# EAGLE schematic Magellan (EAGLE 9.6.2)
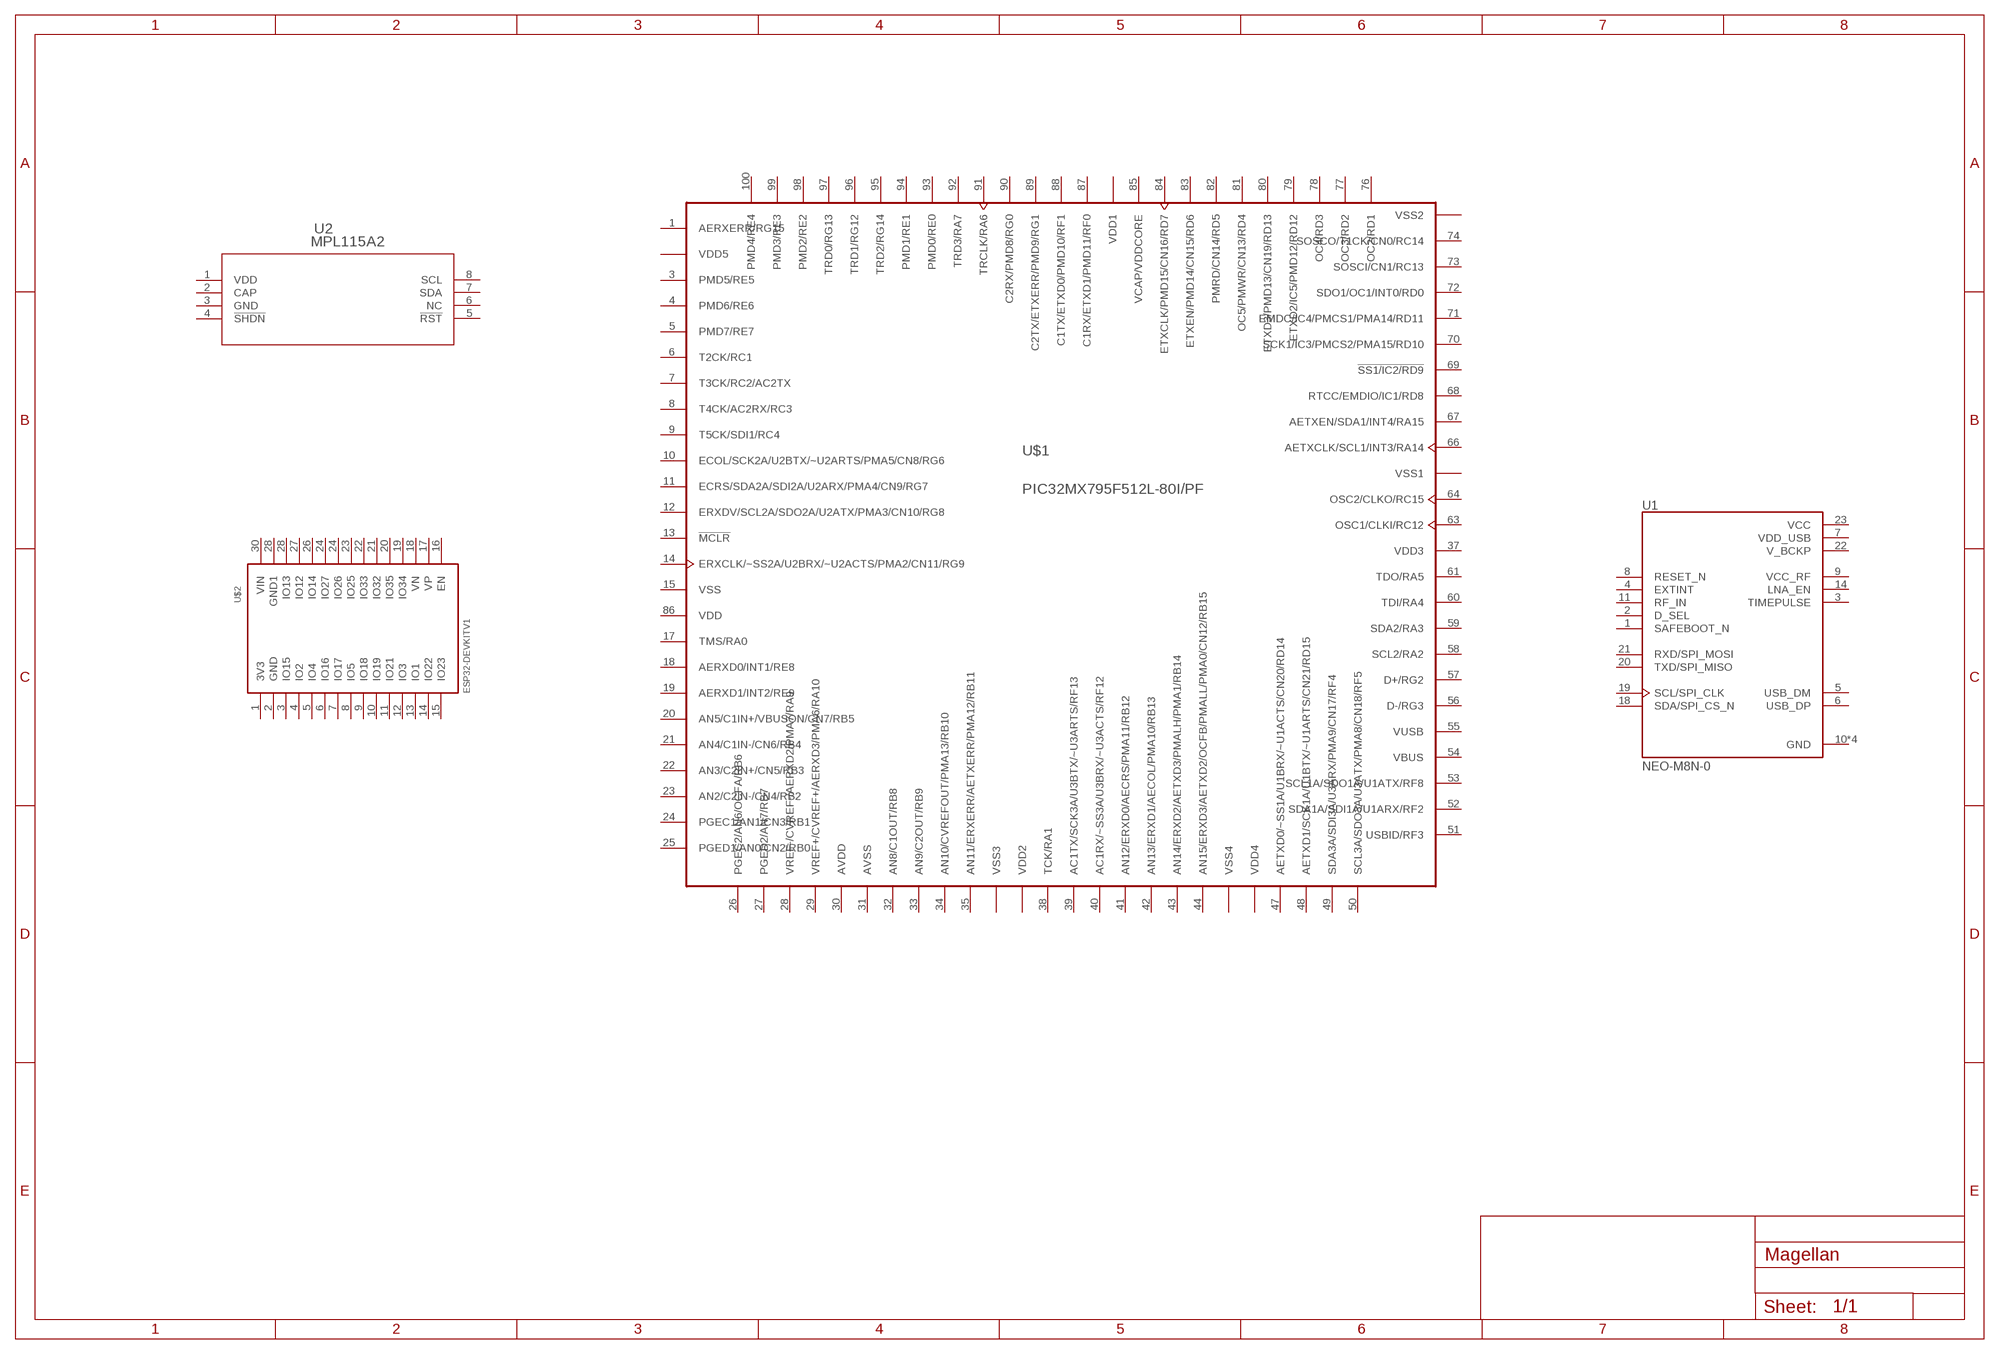
[diagram p0: schematic, sheet 1]

## Parts
U1  NEO-M8N-0  [XCVR_NEO-M8N-0]
U2  MPL115A2  [LGA8_FRE]
U$1  PIC32MX795F512L-80I/PF  [QFP50P1600X1600X120-100N]
U$2  ESP32DEVKITV1  [ESP32-DEVKITV1]
Unconnected: U1.1(SAFEBOOT_N) U1.2(D_SEL) U1.3(TIMEPULSE) U1.4(EXTINT) U1.5(USB_DM) U1.6(USB_DP) U1.8(RESET_N) U1.9(VCC_RF) U1.11(RF_IN) U1.14(LNA_EN) U1.18(SDA/SPI_CS_N) U1.19(SCL/SPI_CLK) U1.20(TXD/SPI_MISO) U1.21(RXD/SPI_MOSI) U2.2(CAP) U2.4(!SHDN) U2.5(!RST) U2.6(NC) U2.7(SDA) U2.8(SCL) U$1.1(AERXERR/RG15) U$1.3(PMD5/RE5) U$1.4(PMD6/RE6) U$1.5(PMD7/RE7) U$1.6(T2CK/RC1) U$1.7(T3CK/RC2/AC2TX) U$1.8(T4CK/AC2RX/RC3) U$1.9(T5CK/SDI1/RC4) U$1.10(ECOL/SCK2A/U2BTX/~U2ARTS/PMA5/CN8/RG6) U$1.11(ECRS/SDA2A/SDI2A/U2ARX/PMA4/CN9/RG7) U$1.12(ERXDV/SCL2A/SDO2A/U2ATX/PMA3/CN10/RG8) U$1.13(!MCLR) U$1.14(ERXCLK/~SS2A/U2BRX/~U2ACTS/PMA2/CN11/RG9) U$1.17(TMS/RA0) U$1.18(AERXD0/INT1/RE8) U$1.19(AERXD1/INT2/RE9) U$1.20(AN5/C1IN+/VBUSON/CN7/RB5) U$1.21(AN4/C1IN-/CN6/RB4) U$1.22(AN3/C2IN+/CN5/RB3) U$1.23(AN2/C2IN-/CN4/RB2) U$1.24(PGEC1/AN1/CN3/RB1) U$1.25(PGED1/AN0/CN2/RB0) U$1.26(PGEC2/AN6/OCFA/RB6) U$1.27(PGED2/AN7/RB7) U$1.28(VREF-/CVREF-/AERXD2/PMA7/RA9) U$1.29(VREF+/CVREF+/AERXD3/PMA6/RA10) U$1.32(AN8/C1OUT/RB8) U$1.33(AN9/C2OUT/RB9) U$1.34(AN10/CVREFOUT/PMA13/RB10) U$1.35(AN11/ERXERR/AETXERR/PMA12/RB11) U$1.38(TCK/RA1) U$1.39(AC1TX/SCK3A/U3BTX/~U3ARTS/RF13) U$1.40(AC1RX/~SS3A/U3BRX/~U3ACTS/RF12) U$1.41(AN12/ERXD0/AECRS/PMA11/RB12) U$1.42(AN13/ERXD1/AECOL/PMA10/RB13) U$1.43(AN14/ERXD2/AETXD3/PMALH/PMA1/RB14) U$1.44(AN15/ERXD3/AETXD2/OCFB/PMALL/PMA0/CN12/RB15) U$1.47(AETXD0/~SS1A/U1BRX/~U1ACTS/CN20/RD14) U$1.48(AETXD1/SCK1A/U1BTX/~U1ARTS/CN21/RD15) U$1.49(SDA3A/SDI3A/U3ARX/PMA9/CN17/RF4) U$1.50(SCL3A/SDO3A/U3ATX/PMA8/CN18/RF5) U$1.51(USBID/RF3) U$1.52(SDA1A/SDI1A/U1ARX/RF2) U$1.53(SCL1A/SDO1A/U1ATX/RF8) U$1.54(VBUS) U$1.56(D-/RG3) U$1.57(D+/RG2) U$1.58(SCL2/RA2) U$1.59(SDA2/RA3) U$1.60(TDI/RA4) U$1.61(TDO/RA5) U$1.63(OSC1/CLKI/RC12) U$1.64(OSC2/CLKO/RC15) U$1.66(AETXCLK/SCL1/INT3/RA14) U$1.67(AETXEN/SDA1/INT4/RA15) U$1.68(RTCC/EMDIO/IC1/RD8) U$1.69(!SS1/IC2/RD9) U$1.70(SCK1/IC3/PMCS2/PMA15/RD10) U$1.71(EMDC/IC4/PMCS1/PMA14/RD11) U$1.72(SDO1/OC1/INT0/RD0) U$1.73(SOSCI/CN1/RC13) U$1.74(SOSCO/T1CK/CN0/RC14) U$1.76(OC2/RD1) U$1.77(OC3/RD2) U$1.78(OC4/RD3) U$1.79(ETXD2/IC5/PMD12/RD12) U$1.80(ETXD3/PMD13/CN19/RD13) U$1.81(OC5/PMWR/CN13/RD4) U$1.82(PMRD/CN14/RD5) U$1.83(ETXEN/PMD14/CN15/RD6) U$1.84(ETXCLK/PMD15/CN16/RD7) U$1.87(C1RX/ETXD1/PMD11/RF0) U$1.88(C1TX/ETXD0/PMD10/RF1) U$1.89(C2TX/ETXERR/PMD9/RG1) U$1.90(C2RX/PMD8/RG0) U$1.91(TRCLK/RA6) U$1.92(TRD3/RA7) U$1.93(PMD0/RE0) U$1.94(PMD1/RE1) U$1.95(TRD2/RG14) U$1.96(TRD1/RG12) U$1.97(TRD0/RG13) U$1.98(PMD2/RE2) U$1.99(PMD3/RE3) U$1.100(PMD4/RE4) U$2.1(3V3) U$2.2(GND) U$2.3(IO15) U$2.4(IO2) U$2.5(IO4) U$2.6(IO16) U$2.7(IO17) U$2.8(IO5) U$2.9(IO18) U$2.10(IO19) U$2.11(IO21) U$2.12(IO3) U$2.13(IO1) U$2.14(IO22) U$2.15(IO23) U$2.16(EN) U$2.17(VP) U$2.18(VN) U$2.19(IO34) U$2.20(IO35) U$2.21(IO32) U$2.22(IO33) U$2.23(IO25) U$2.24(IO26) U$2.24(IO27) U$2.26(IO14) U$2.27(IO12) U$2.28(GND1) U$2.28(IO13) U$2.30(VIN)

## Power pins joined to a net without a drawn wire
AVDD: U$1.30(AVDD)
AVSS: U$1.31(AVSS)
GND: U1.10(GND) U1.12(GND) U1.13(GND) U1.24(GND) U2.3(GND)
V_BCKP: U1.22(V_BCKP)
VCAP/VDDCORE: U$1.85(VCAP/VDDCORE)
VCC: U1.23(VCC)
VDD: U2.1(VDD) U$1.86(VDD)
VDD1: U$1.62(VDD1)
VDD2: U$1.46(VDD2)
VDD3: U$1.37(VDD3)
VDD4: U$1.16(VDD4)
VDD5: U$1.2(VDD5)
VDD_USB: U1.7(VDD_USB)
VSS: U$1.15(VSS)
VSS1: U$1.75(VSS1)
VSS2: U$1.65(VSS2)
VSS3: U$1.45(VSS3)
VSS4: U$1.36(VSS4)
VUSB: U$1.55(VUSB)

## Library data of the parts
U1 = NEO-M8N-0:NEO-M8N-0: Ic Receiver Gps/Gnss 24lcc; DESCRIPTION: NEO-M8 RF Receiver BeiDou, Galileo, GLONASS, GNSS, GPS 1.575GHz -167dBm; DIGI-KEY_PART_NUMBER: 672-NEO-M8N-0CT-ND; MF: U-Blox America; MP: NEO-M8N-0; PACKAGE: SMD-24 U-Blox America Inc.; PURCHASE-URL: https://pricing.snapeda.com/search/part/NEO-M8N-0/?ref=eda
U2 = mpl115A2:MPL115A2; BUILT_BY: EMA_UL_Team; MANUFACTURER_PART_NUMBER: MPL115A2; SOURCELIBRARY: Freescale_2013-06-03a; VENDOR: Freescale
U$1 = PIC32MX795F512L-80I_PF:PIC32MX795F512L-80I/PF: Check prices <https://pricing.snapeda.com/parts/PIC32MX795F512L-80I/PF/Microchip/view-part?ref=eda>; AVAILABILITY: Good; DESCRIPTION: MIPS32® M4K™ PIC® 32MX Microcontroller IC 32-Bit 80MHz 512KB (512K x 8) FLASH 100-TQFP (14x14); MF: Microchip; MP: PIC32MX795F512L-80I/PF; PACKAGE: TQFP-100 Microchip; PRICE: None; PURCHASE-URL: https://pricing.snapeda.com/search/part/PIC32MX795F512L-80I/PF/?ref=eda
U$2 = ESP32-DEVKITV1:ESP32DEVKITV1